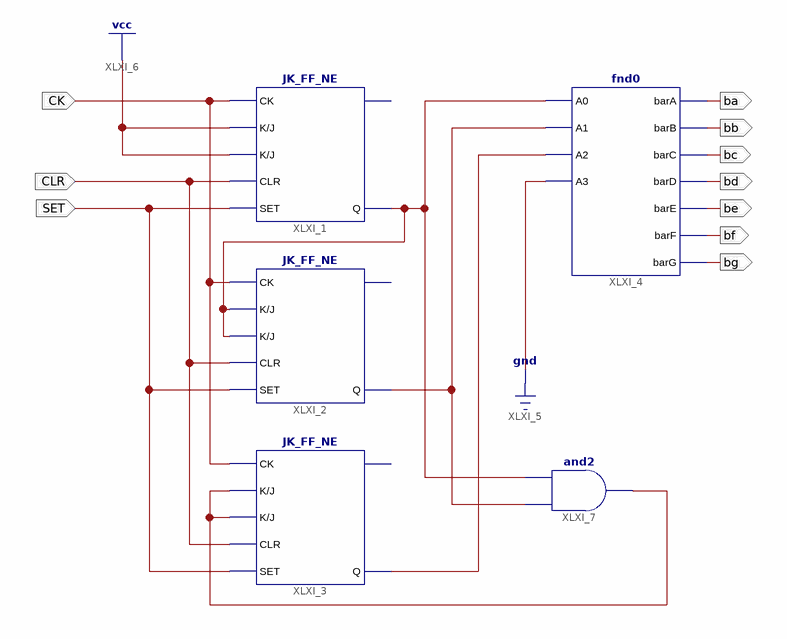
[diagram p0: schematic sheet 1]
// Xilinx ISE schematic Mod8.sch (spartan6) as structural Verilog: 5 symbols, 10 ports
module Mod8 (
  input  CK,
  input  CLR,
  input  SET,
  output ba,
  output bb,
  output bc,
  output bd,
  output be,
  output bf,
  output bg
);

  wire XLXN_12, XLXN_13, XLXN_18, XLXN_20;

  JK_FF_NE XLXI_1 (.CK(CK), .K(1'b1), .J(1'b1), .CLR(CLR), .SET(SET), .Q(XLXN_20));  // open: bQ
  JK_FF_NE XLXI_2 (.CK(CK), .K(XLXN_20), .J(XLXN_20), .CLR(CLR), .SET(SET), .Q(XLXN_12));  // open: bQ
  JK_FF_NE XLXI_3 (.CK(CK), .K(XLXN_18), .J(XLXN_18), .CLR(CLR), .SET(SET), .Q(XLXN_13));  // open: bQ
  fnd0 XLXI_4 (
    .A3(1'b0), .A2(XLXN_13), .A1(XLXN_12), .A0(XLXN_20), .barA(ba), .barB(bb), .barC(bc), .barD(bd),
    .barE(be), .barF(bf), .barG(bg));
  and XLXI_7 (XLXN_18, XLXN_12, XLXN_20);
endmodule
